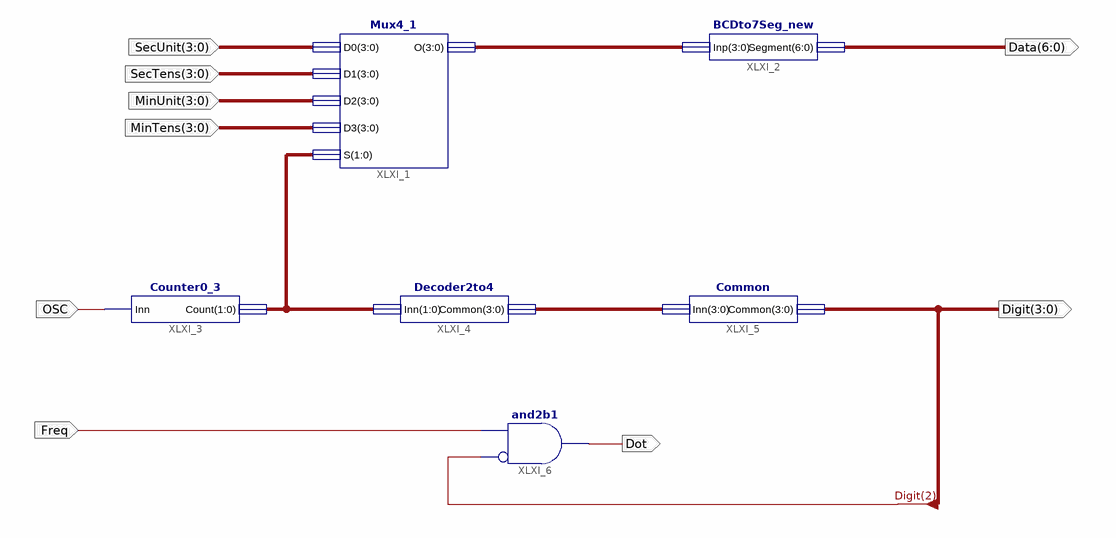
[diagram p0: schematic sheet 1]
// Xilinx ISE schematic Display.sch (spartan6) as structural Verilog: 6 symbols, 9 ports
module Display (
  input  [3:0] SecUnit,
  input  [3:0] SecTens,
  input  [3:0] MinUnit,
  input  [3:0] MinTens,
  input  OSC,
  input  Freq,
  output [6:0] Data,
  output [3:0] Digit,
  output Dot
);

  wire [1:0] XLXN_10;
  wire [3:0] XLXN_8, XLXN_12;

  Mux4_1 XLXI_1 (.D0(SecUnit), .D1(SecTens), .D2(MinUnit), .D3(MinTens), .S(XLXN_10), .O(XLXN_8));
  BCDto7Seg_new XLXI_2 (.Inp(XLXN_8), .Segment(Data));
  Counter0_3 XLXI_3 (.Count(XLXN_10), .Inn(OSC));
  Decoder2to4 XLXI_4 (.Inn(XLXN_10), .Common(XLXN_12));
  Common XLXI_5 (.Inn(XLXN_12), .Common(Digit));
  and XLXI_6 (Dot, ~Digit[2], Freq);  // and2b1
endmodule
